# Altium schematic sheet SUP_1.2_1.8.SchDoc
size A4; DocumentNumber: 6; SheetNumber: 6; SheetTotal: 30
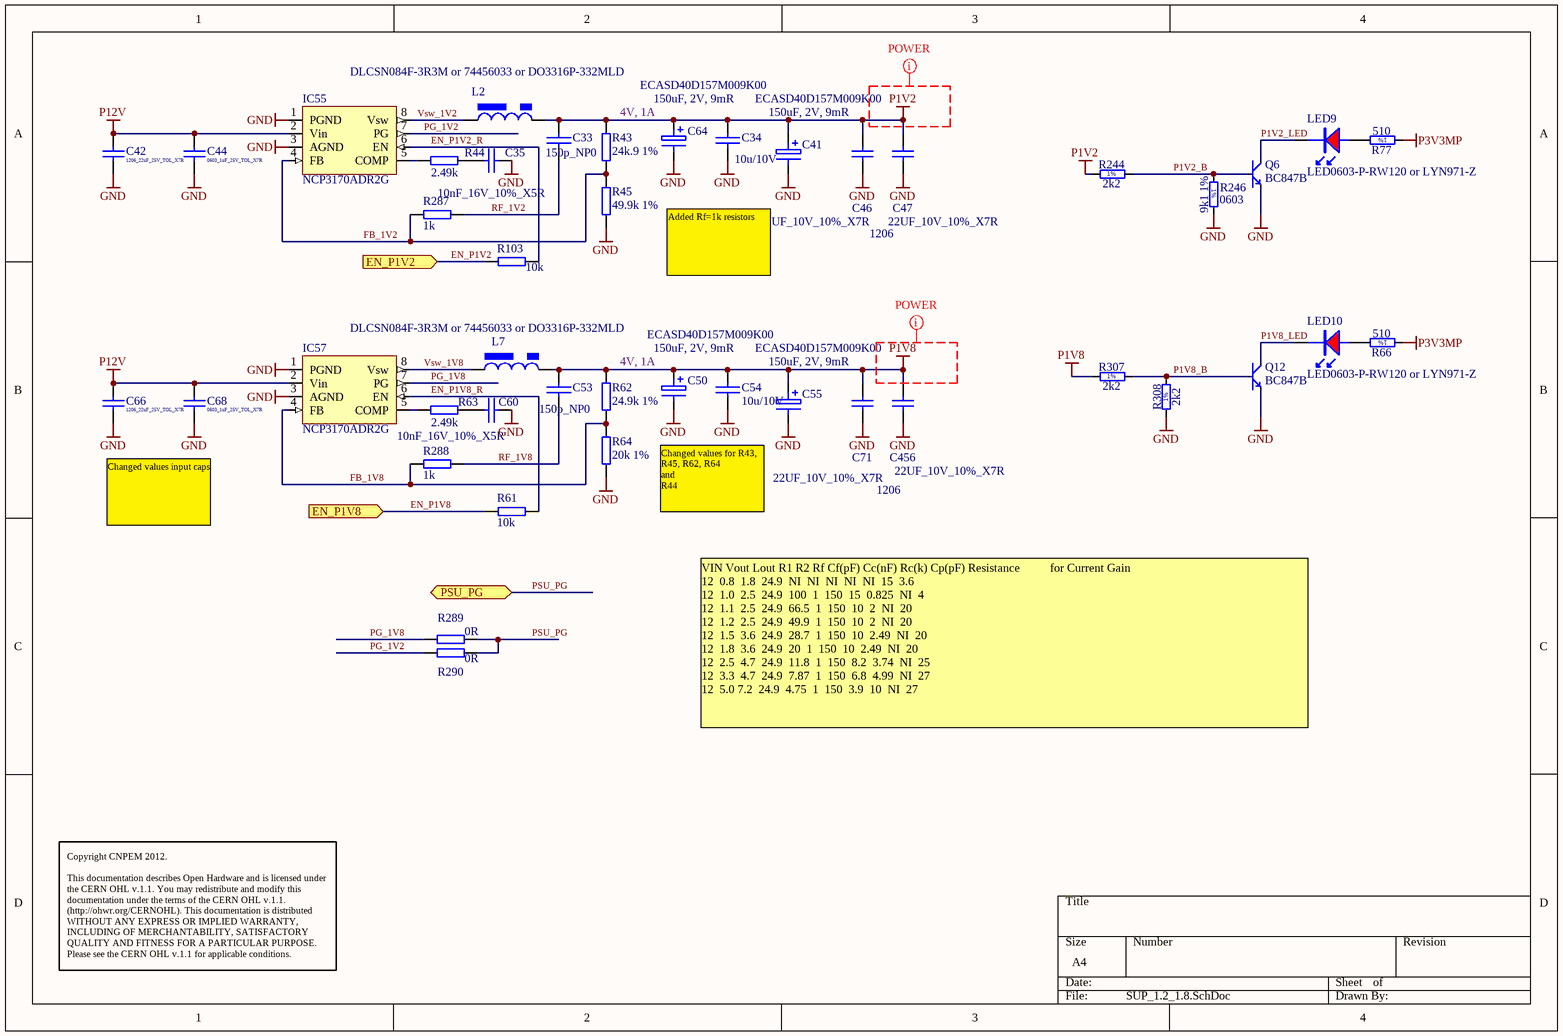
[diagram p0: SUP_1.2_1.8.SchDoc]

## Parts
C33  150p_NP0  [0603C]
C34  10u/10V  [0805C]
C35  10nF_16V_10%_X5R  [0603C]
C41  ECASD40D157M009K00  value 150uF, 2V, 9mR  [2917_POLY]
C42  1206_22uF_25V_TOL_X7R  [CAPC3225X140N]
C44  0603_1uF_25V_TOL_X7R  [CAPC1608X90N]
C46  22UF_10V_10%_X7R  [1206C]
C47  22UF_10V_10%_X7R  Case: 1206  [1206C]
C50  ECASD40D157M009K00  value 150uF, 2V, 9mR  [2917_POLY]
C53  150p_NP0  [0603C]
C54  10u/10V  [0805C]
C55  ECASD40D157M009K00  value 150uF, 2V, 9mR  [2917_POLY]
C60  10nF_16V_10%_X5R  [0603C]
C64  ECASD40D157M009K00  value 150uF, 2V, 9mR  [2917_POLY]
C66  1206_22uF_25V_TOL_X7R  [CAPC3225X140N]
C68  0603_1uF_25V_TOL_X7R  [CAPC1608X90N]
C71  22UF_10V_10%_X7R  [1206C]
C456  22UF_10V_10%_X7R  Case: 1206  [1206C]
IC55  NCP3170ADR2G  [so-8]
IC57  NCP3170ADR2G  [so-8]
L2  DLCSN084F-3R3M or 74456033 or DO3316P-332MLD  [IND_CSN084F]
L7  DLCSN084F-3R3M or 74456033 or DO3316P-332MLD  [IND_CSN084F]
LED9  LED0603-P-RW120 or LYN971-Z  [led_0603R]
LED10  LED0603-P-RW120 or LYN971-Z  [led_0603R]
Q6  BC847B  [SOT-23]
Q12  BC847B  [SOT-23]
R43  24k.9 1%  [0603R]
R44  2.49k  [0603R]
R45  49.9k 1%  [0603R]
R61  10k  [0402R]
R62  24.9k 1%  [0603R]
R63  2.49k  [0603R]
R64  20k 1%  [0603R]
R66  510  [0603R]
R77  510  [0603R]
R103  10k  [0402R]
R244  2k2  [RESC1608X55N]
R246  9k1 1%  Case: 0603  [0603R]
R287  1k  [0603R]
R288  1k  [0603R]
R289  0R  [0402R]
R290  0R  [0402R]
R307  2k2  [RESC1608X55N]
R308  2k2  [RESC1608X55N]

## Ports
EN_P1V2 (in), EN_P1V8 (in), PSU_PG

## Nets
GND: C34.2 C35.2 C41.2 C42.1 C44.1 C46.2 C47.2 C50.2 C54.2 C55.2 C60.2 C64.2 C66.1 C68.1 C71.2 C456.2 IC55.1(PGND) IC55.3(AGND) IC57.1(PGND) IC57.3(AGND) Q6.2(E) Q12.2(E) R45.1 R64.1 R246.2 R308.1
P1V2: C33.1 C34.1 C41.1 C46.1 C47.1 C64.1 L2.2 R43.2 R244.1
P1V8: C50.1 C53.1 C54.1 C55.1 C71.1 C456.1 L7.2 R62.2 R307.1
P3V3MP: R66.1 R77.1
P12V: C42.2 C44.2 C66.2 C68.2 IC55.2(Vin) IC57.2(Vin)
EN_P1V2: R103.1 ; port EN_P1V2
EN_P1V2_R: IC55.6(EN) R103.2
EN_P1V8: R61.1 ; port EN_P1V8
EN_P1V8_R: IC57.6(EN) R61.2
FB_1V2: IC55.4(FB) R43.1 R45.2 R287.2
FB_1V8: IC57.4(FB) R62.1 R64.2 R288.2
P1V2_B: Q6.1(B) R244.2 R246.1
P1V2_LED: LED9.K Q6.3(C)
P1V8_B: Q12.1(B) R307.2 R308.2
P1V8_LED: LED10.K Q12.3(C)
PG_1V2: IC55.7(PG) R290.2
PG_1V8: IC57.7(PG) R289.2
PSU_PG: R289.1 R290.1 ; port PSU_PG
RF_1V2: C33.2 R287.1
RF_1V8: C53.2 R288.1
Vsw_1V2: IC55.8(Vsw) L2.1
Vsw_1V8: IC57.8(Vsw) L7.1
NetC35_1: C35.1 R44.1
NetC60_1: C60.1 R63.1
NetIC55_5: IC55.5(COMP) R44.2
NetIC57_5: IC57.5(COMP) R63.2
NetLED9_A: LED9.A R77.2
NetLED10_A: LED10.A R66.2

## Layout directives
net class POWER: P1V2, P1V8

## Notes on the sheet
- 4V, 1A
- Added Rf=1k resistors
- Changed values input caps
- Changed values for R43, R45, R62, R64
  and
  R44
- VIN	Vout	Lout	R1	R2	Rf	Cf(pF)	Cc(nF)	Rc(k)	Cp(pF) Resistance 									for Current Gain
  12 	0.8 	1.8 	24.9 	NI 	NI 	NI 	NI 	NI 	15 	3.6
  12 	1.0 	2.5 	24.9 	100 	1 	150 	15 	0.825 	NI 	4
  12 	1.1 	2.5 	24.9 	66.5 	1 	150 	10 	2 	NI 	20
  12 	1.2 	2.5 	24.9 	49.9 	1 	150 	10 	2 	NI 	20
  12 	1.5 	3.6 	24.9 	28.7 	1 	150 	10 	2.49 	NI 	20
  12 	1.8 	3.6 	24.9 	20 	1 	150 	10 	2.49 	NI 	20
  12 	2.5 	4.7 	24.9 	11.8 	1 	150 	8.2 	3.74 	NI 	25
  12 	3.3 	4.7 	24.9 	7.87 	1 	150 	6.8 	4.99 	NI 	27
  12 	5.0	7.2 	24.9 	4.75 	1 	150 	3.9 	10 	NI 	27
- Copyright CNPEM 2012.
  This documentation describes Open Hardware and is licensed under the CERN OHL v.1.1. You may redistribute and modify this documentation under the terms of the CERN OHL v.1.1. (http://ohwr.org/CERNOHL). This documentation is distributed WITHOUT ANY EXPRESS OR IMPLIED WARRANTY, INCLUDING OF MERCHANTABILITY, SATISFACTORY QUALITY AND FITNESS FOR A PARTICULAR PURPOSE. Please see the CERN OHL v.1.1 for applicable conditions.
- (in symbol R0402_510R_1%_0.0625W_100PPM) 1%
- (in symbol R0603_2K2_1%_0.1W_100PPM) 1%
- (in symbol R0603_9K1_1%_0.1W_100PPM) 1%

## Library data of the parts
C33 C35 C53 C60 = CAP_SMD_0603: Capacitor SMD
C34 C54 = CAP_SMD_0805: Capacitor SMD; Supplier 1: Farnell; Supplier Part Number 1: 1833812
C41 C50 C55 C64 = CAP_POLYMER: POLY, 150uF, 2V, ESR: 9mR
C42 C66 = Ceramic_1206: MiscInfo: Biggest Cern Footprint [max height]; Document Name: SUP_1.2_1.8.SchDoc; Part Number: Ceramic_1206; FootprintSizeX (mm): 4.65; FootprintSizeY (mm): 2.3; FootprintRectangleArea (mm): 10.7; Thickness (Max) (mm): 1.8; FootprintAlias: 1206
C44 C68 = Ceramic_0603: MiscInfo: Biggest Cern Footprint [max height]; Document Name: SUP_1.2_1.8.SchDoc; Part Number: Ceramic_0603; FootprintSizeX (mm): 3; FootprintSizeY (mm): 1.5; FootprintRectangleArea (mm): 4.5; Thickness (Max) (mm): 0.9; FootprintAlias: 0603
C46 C47 C71 C456 = CC1206_22UF_10V_10%_X7R: Non-polarised capacitor; Part Description: SMD Multilayer Chip Ceramic Capacitor; Manufacturer: GENERIC; Manufacturer1 Part Number: GRM31CR71A226KE15L; Value: 22uF; Voltage: 10V; TC: X7R; Tolerance: ±10%; Table: Capacitors SMD; Part Number: CC1206_22UF_10V_10%_X7R; Component Kind: Standard; Component Type: Standard; Footprint: CAPC3216X180N; Pin Count: 2; Status: Preferred; Manufacturer Part Number: CC1206_22UF_10V_10%_X7R; Mounted: Yes; Socket: No; SMD: Yes; Manufacturer1 Example: MURATA; Manufacturer1 ComponentHeight: 1.8mm; HelpURL: \\cern.ch\dfs\Applications\Altium\Datasheets\CC1206_X7R_MURATA_GRM-HI-CAP.pdf; Author: CERN DEM JLC; CreateDate: 08/06/2010; LatestRevisionDate: 08/06/2010
IC55 IC57 = PWM_NCP3170: 4.5V to 18V, 3A synch buck
L2 L7 = L_POWER_CSN084F_3R3: 3.3uH, 20%, 5.4A, 0.015R
LED9 LED10 = LED_0603R: LED 0603 red; Supplier 1: Newark; Supplier Part Number 1: 22M3004; Supplier 2: Newark; Supplier Part Number 2: 20M0618
Q6 Q12 = Q_BC847B: Transistor
R43-R45 R62-R64 R287 R288 = RES_0603: SMD Resistor
R61 R103 = RES_SMD: SMD Resistor
R66 R77 = R0402_510R_1%_0.0625W_100PPM: Resistor - 1%; Part Description: General Purpose Thick Film Chip Resistor; Manufacturer: GENERIC; Manufacturer1 Part Number: 232270675101; TC: ±100ppm/°C; Table: Resistors SMD; Part Number: R0402_510R_1%_0.0625W_100PPM; Component Kind: Standard; Component Type: Standard; Footprint: RESC1005X40N; Pin Count: 2; Value: 510; Status: Not recommended; Power: 0.0625W; Tolerance: ±1%; Manufacturer Part Number: R0402_510R_1%_0.0625W_100PPM; Case: 0402; Mounted: Yes; Socket: No; SMD: Yes; Manufacturer1 Example: PHYCOMP; Manufacturer1 ComponentHeight: 0.4mm; HelpURL: \\cern.ch\dfs\Applications\Altium\Datasheets\R0402_Phycomp_RC0402.pdf; Author: CERN DEM JLC; CreateDate: 2007-12-03; LatestRevisionDate: 2008-03-13
R244 R307 R308 = R0603_2K2_1%_0.1W_100PPM: Resistor - 1%; Part Description: General Purpose Thick Film Chip Resistor; Manufacturer: GENERIC; Manufacturer1 Part Number: NRC06F2201TRF; Power: 0.1W; TC: ±100ppm/°C; Table: Resistors SMD; Part Number: R0603_2K2_1%_0.1W_100PPM; Component Kind: Standard; Component Type: Standard; Pin Count: 2; Value: 2k2; Status: Preferred; Tolerance: ±1%; Manufacturer Part Number: R0603_2K2_1%_0.1W_100PPM; Case: 0603; Mounted: Yes; Socket: No; SMD: Yes; Manufacturer1 Example: NIC COMPONENT; Manufacturer1 ComponentHeight: 0.55mm; HelpURL: \\cern.ch\dfs\Applications\Altium\Datasheets\R0603_NIC_NRC.pdf; Author: CERN DEM JLC; CreateDate: 2007-12-03; LatestRevisionDate: 2008-03-13
R246 = R0603_9K1_1%_0.1W_100PPM: Resistor - 1%; Part Description: General Purpose Thick Film Chip Resistor; Manufacturer: GENERIC; Manufacturer1 Part Number: NRC06F9101TRF; Power: 0.1W; TC: ±100ppm/°C; Table: Resistors SMD; Part Number: R0603_9K1_1%_0.1W_100PPM; Component Kind: Standard; Component Type: Standard; Footprint: RESC1608X55N; Pin Count: 2; Value: 9k1; Status: Preferred; Tolerance: ±1%; Manufacturer Part Number: R0603_9K1_1%_0.1W_100PPM; Mounted: Yes; Socket: No; SMD: Yes; Manufacturer1 Example: NIC COMPONENT; Manufacturer1 ComponentHeight: 0.55mm; HelpURL: \\cern.ch\dfs\Applications\Altium\Datasheets\R0603_NIC_NRC.pdf; Author: CERN DEM JLC; CreateDate: 2007-12-03; LatestRevisionDate: 2008-03-13
R289 R290 = RES_0402: SMD Resistor; Supplier 1: Newark; Supplier Part Number 1: 59M6691